# Altium schematic sheet Tactile switch SCH.schdoc
size 127 x 99 mm
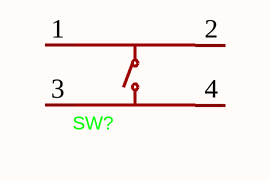
[diagram p0: Tactile switch SCH.schdoc]

## Parts
SW?  PTS645SH50SMTR92LFS  [KEY-SMD_4P-L6.0-W6.0-P4.50-LS9.0]  (value not drawn)

## Nets

Not connected (* = marked no-connect by the designer): SW? 1 2 3 4

## Library data of the parts
SW? = PTS645SH50SMTR92LFS: Tactile Switch SPST-NO Top Actuated Surface Mount; Manufacturer: C&K; Add into BOM: yes; Circuit: SPST; Actuator Style: Round Button; Operating Force: 200gf; Switch Length: 6mm; Switch Height: 5mm; Contact Current: 50mA; Voltage Rating (DC): 12V; Pin Style: Gullwing; Symbol: PTS645SH50SMTR92LFS; Device: PTS645SH50SMTR92LFS; LCSC Part Name: 6*6*5mm 立贴 轻触开关; Supplier Part: C221869; Manufacturer Part: PTS645SH50SMTR92LFS; Supplier Footprint: SMD,6x6mm; JLCPCB Part Class: Extended Part; Datasheet: https://atta.szlcsc.com/upload/public/pdf/source/20190108/C285530_E89B379DE8DD14E424006A6061D0203A.pdf; Supplier: LCSC; Convert to PCB: yes; Mounting Style: Standing paste; Switch Width: 6mm; With Lamp: -; Mechanical Life: -; Operating Temperature: -40℃~+85℃; LCSC Part Number: C221869